# Altium schematic sheet Bluetooth.SchDoc
size A4
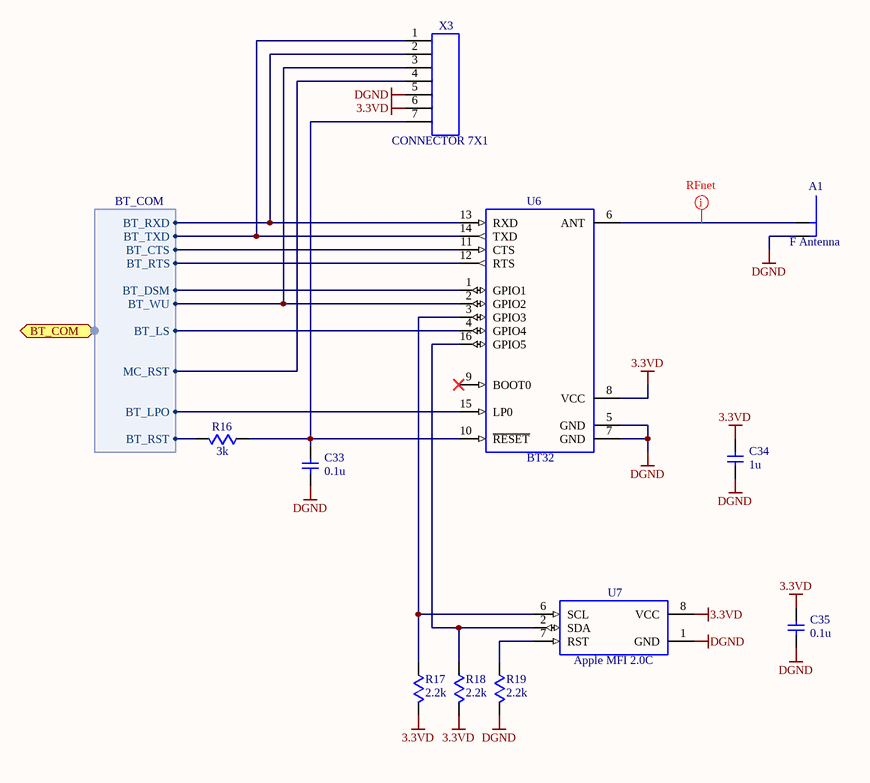
[diagram p0: Bluetooth.SchDoc]

## Parts
A1  F Antenna  [PCB inverted F antenna mirror]  (net tie, no BOM)
C33  0.1u  [SMD/C/0603]
C34  1u  [SMD/C/0603]
C35  0.1u  [SMD/C/0603]
R16  3k  [SMD/R/0603]
R17  2.2k  [SMD/R/0603]
R18  2.2k  [SMD/R/0603]
R19  2.2k  [SMD/R/0603]
U6  BT32  [BT32]
U7  Apple MFI 2.0C  [Apple MFI 2.0C]
X3  CONNECTOR 7X1  [CONNECTOR/IDC/0.05P/1X7]

## Ports
BT_COM (harness BT_COM)

## Harnesses
BT_COM: BT_RXD, BT_TXD, BT_CTS, BT_RTS, BT_DSM, BT_LPO, BT_LS, BT_RST, BT_WU, MC_RST

## Nets
3.3VD: C34.2 C35.2 R17.2 R18.2 U6.8(VCC) U7.8(VCC) X3.6
DGND: A1.2 C33.1 C34.1 C35.1 R19.2 U6.5(GND) U6.7(GND) U7.1(GND) X3.5
NetA1_1: A1.1 U6.6(ANT)
NetC33_2: C33.2 R16.1 U6.10(~{RESET}) X3.7
NetR16_2: R16.2 ; port BT_COM.BT_RST
NetR17_1: R17.1 U6.3(GPIO3) U7.6(SCL)
NetR18_1: R18.1 U6.16(GPIO5) U7.2(SDA)
NetR19_1: R19.1 U7.7(RST)
NetU6_1: U6.1(GPIO1) ; port BT_COM.BT_DSM
NetU6_2: U6.2(GPIO2) X3.3 ; port BT_COM.BT_WU
NetU6_4: U6.4(GPIO4) ; port BT_COM.BT_LS
NetU6_11: U6.11(CTS) ; port BT_COM.BT_CTS
NetU6_12: U6.12(RTS) ; port BT_COM.BT_RTS
NetU6_13: U6.13(RXD) X3.2 ; port BT_COM.BT_RXD
NetU6_14: U6.14(TXD) X3.1 ; port BT_COM.BT_TXD
NetU6_15: U6.15(LP0) ; port BT_COM.BT_LPO
NetX3_4: X3.4 ; port BT_COM.MC_RST

Not connected (* = marked no-connect by the designer): U6 9(BOOT0)*

## Layout directives
net class RFnet: NetA1_1

## Library data of the parts
C33-C35 = Capacitor
  C33 C35: Value: 0.1u
  C34: Value: 1u
R16-R19 = Resistor
  R16: Value: 3k
  R17-R19: Value: 2.2k
U6 = BT32: Bluetooth module; Value: BT32
U7 = Apple MFI 2.0C: Apple Authentication Coprocessor 2.0C; Value: Apple MFI 2.0C
A1 = F Antenna: Value: F Antenna
X3 = CONNECTOR 7X1: Value: CONNECTOR 7X1